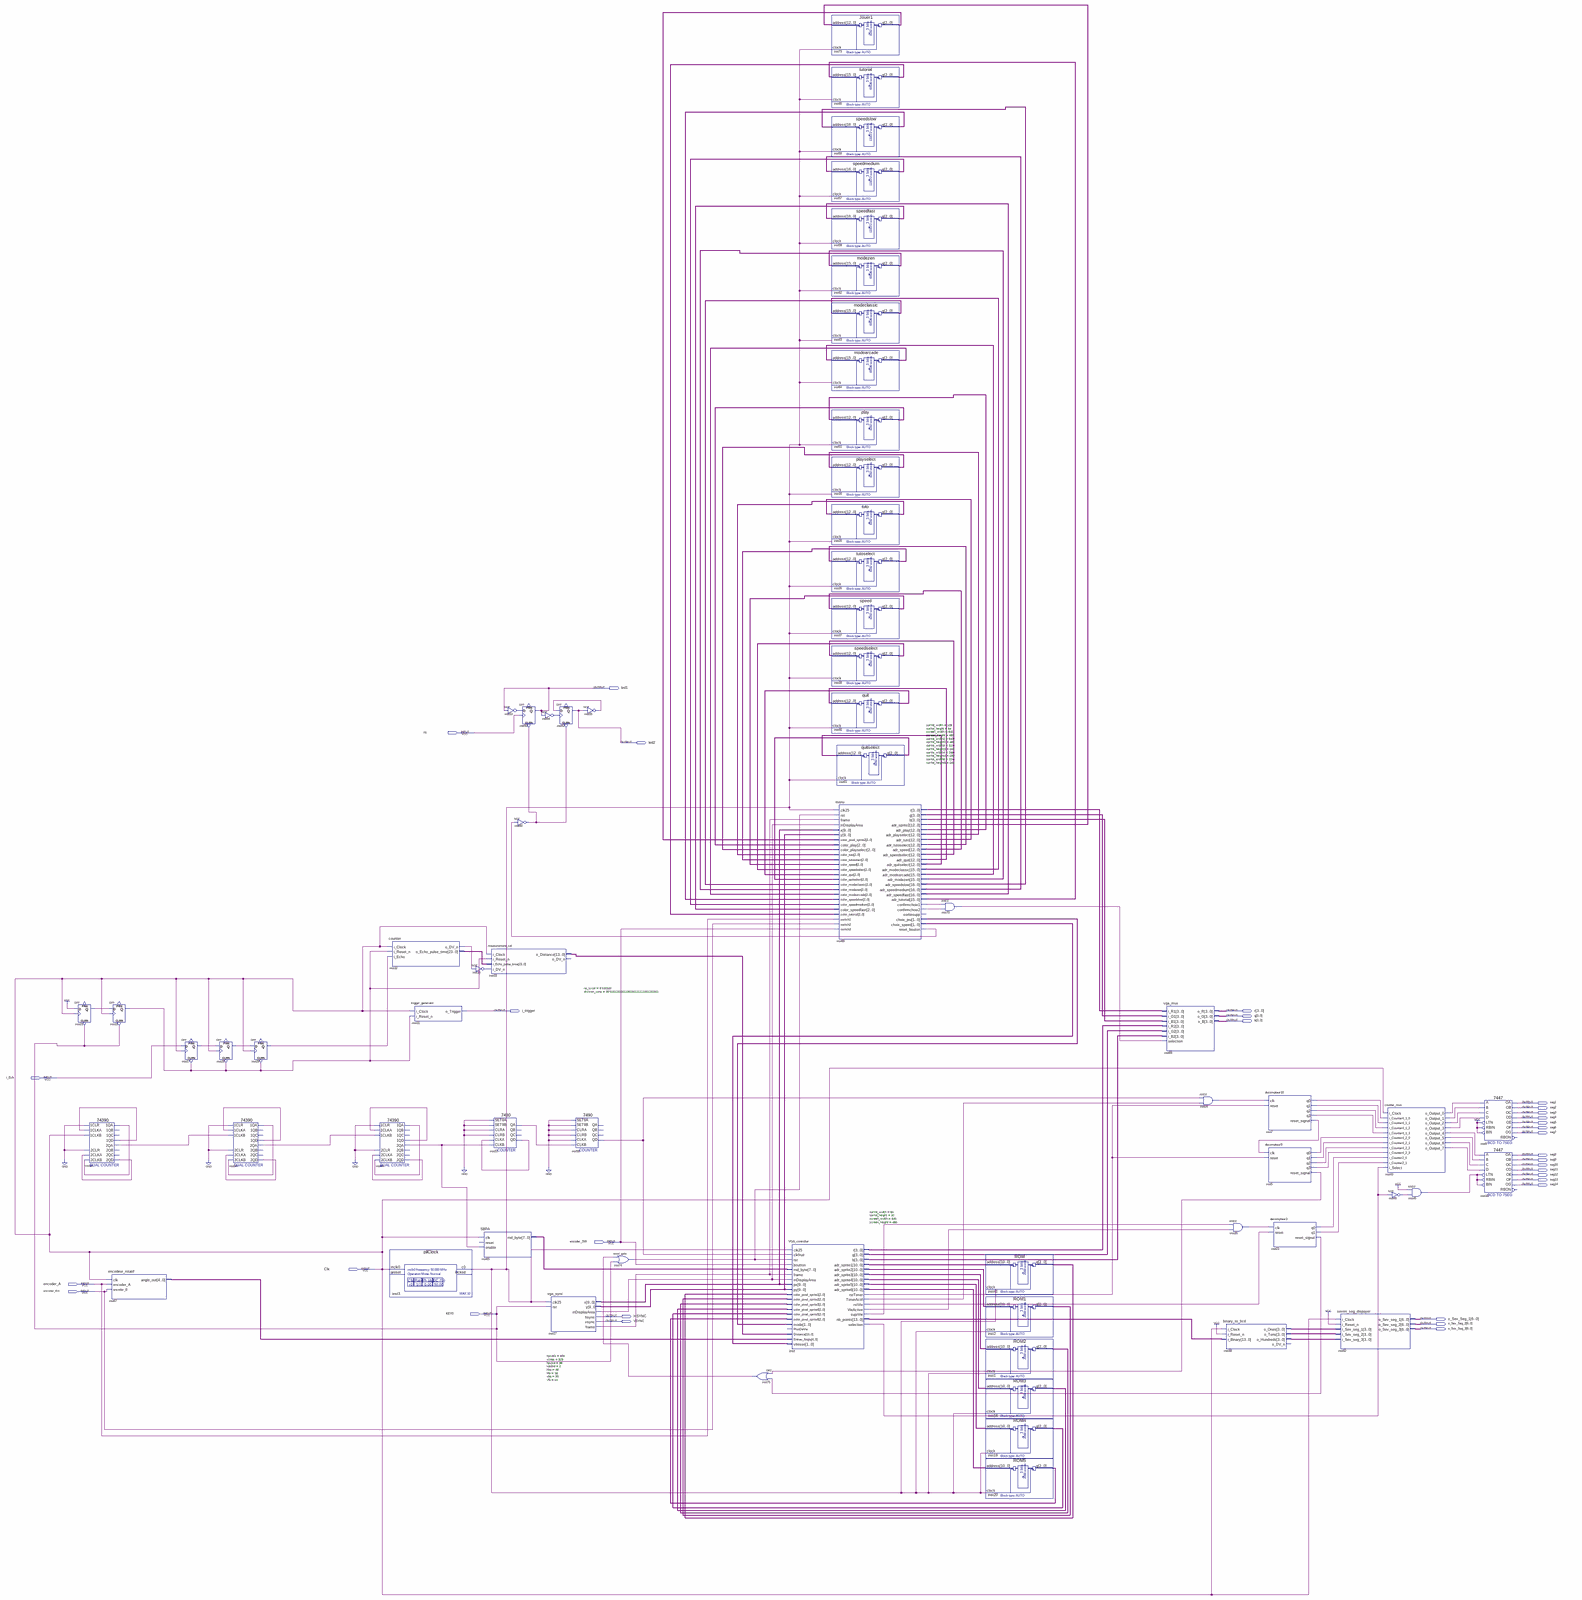
[diagram p0: schematic sheet, whole]
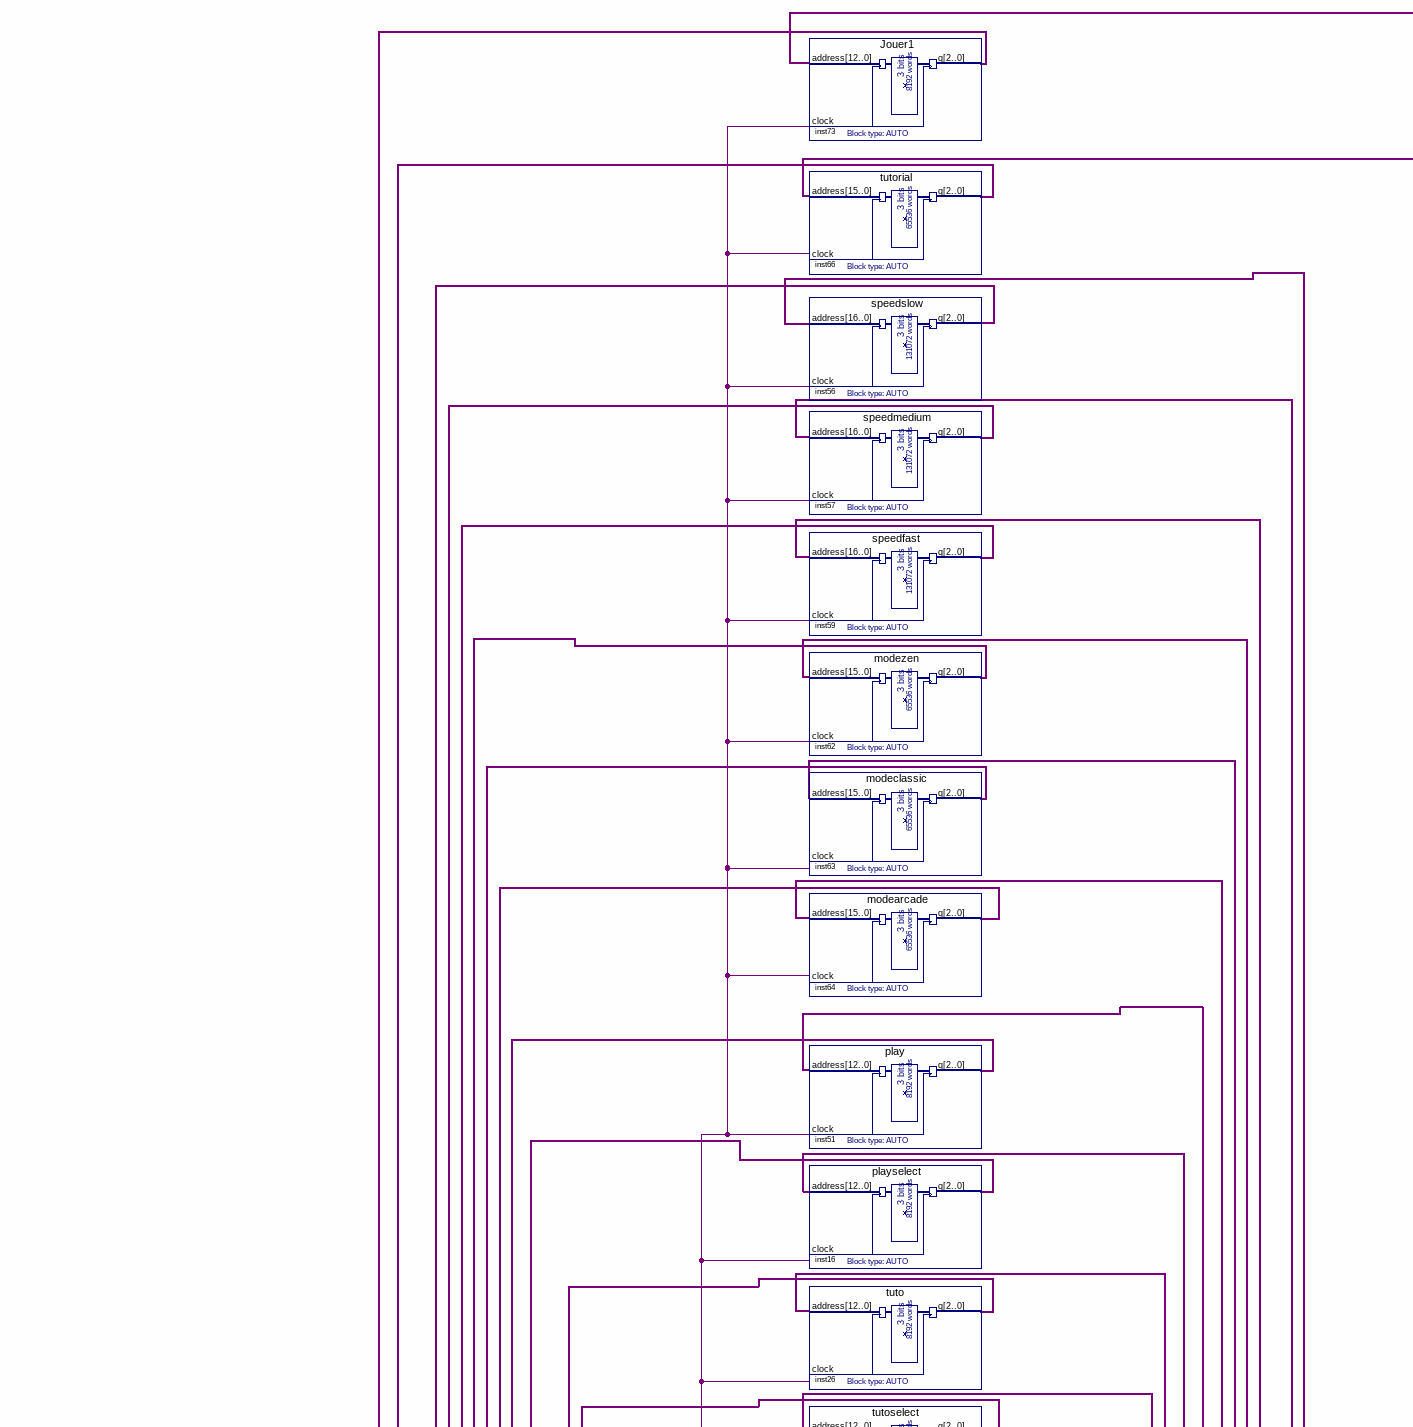
[diagram p1: schematic sheet, upper centre part]
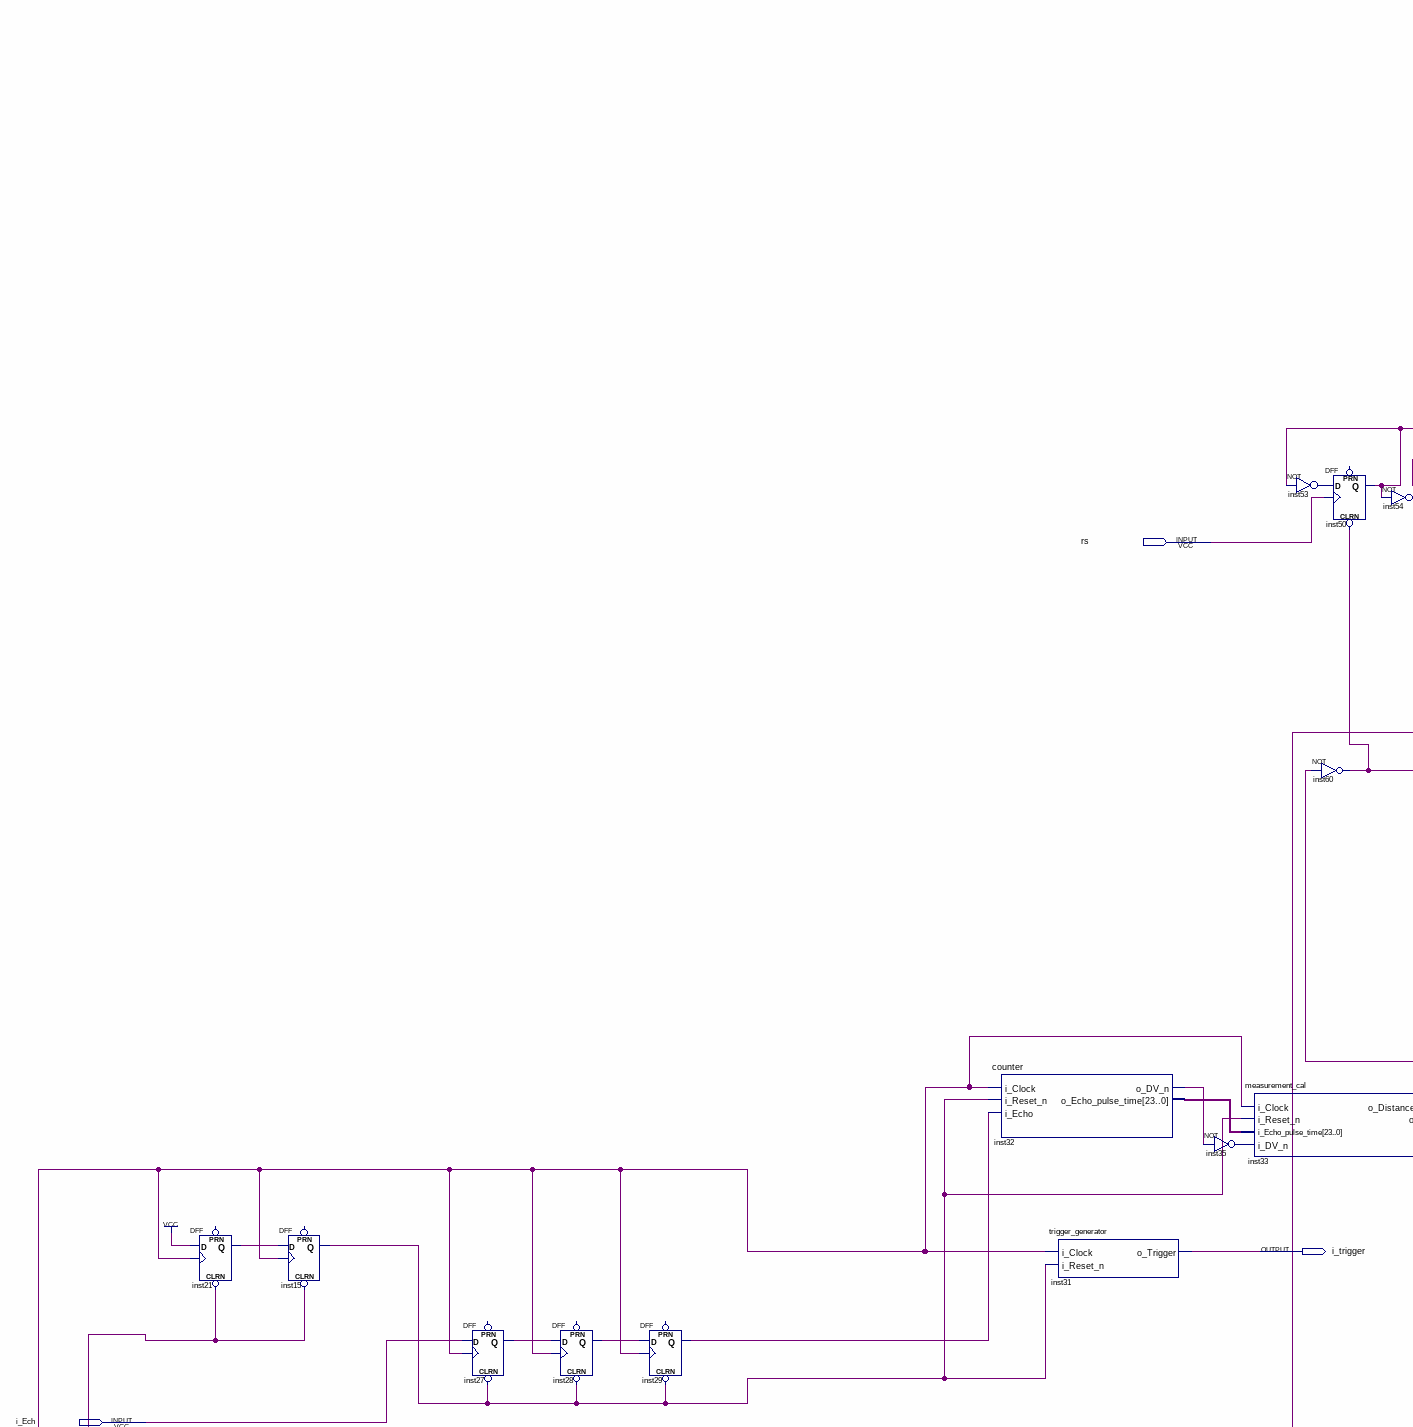
[diagram p2: schematic sheet, middle left part]
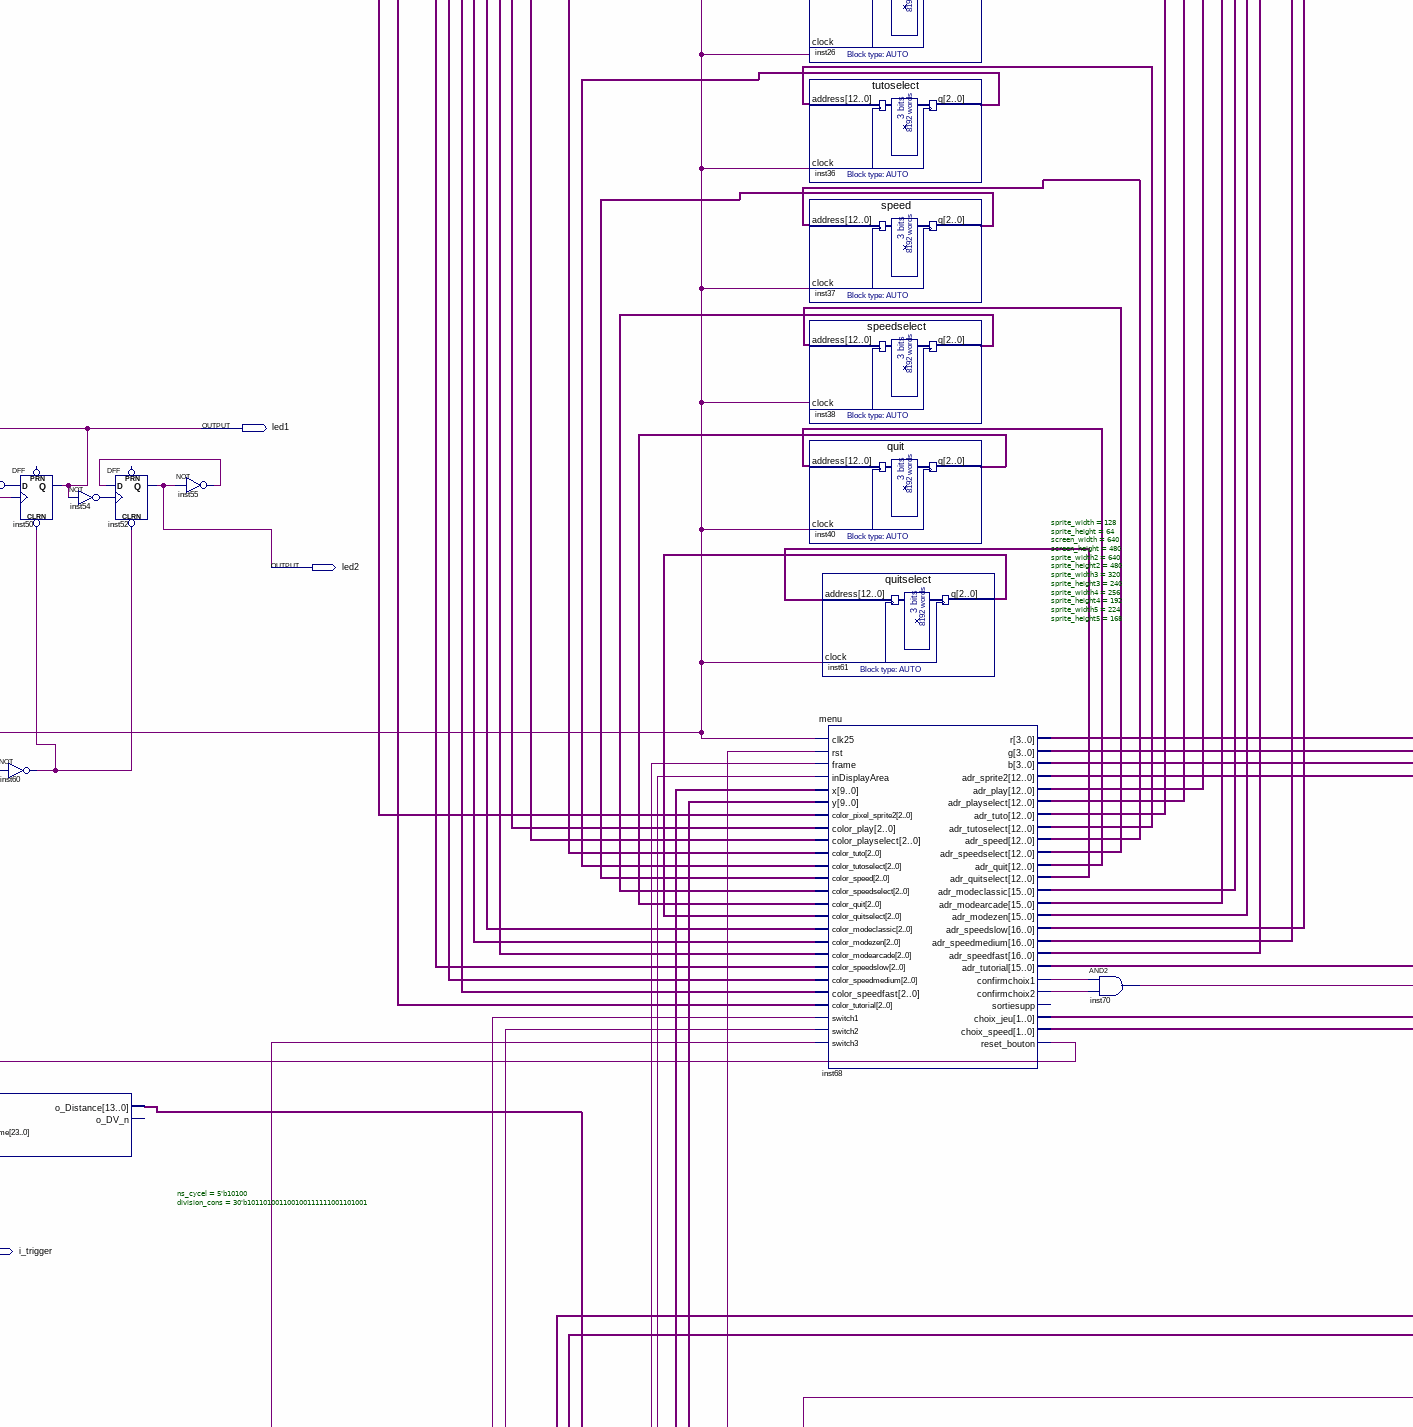
[diagram p3: schematic sheet, middle centre part]
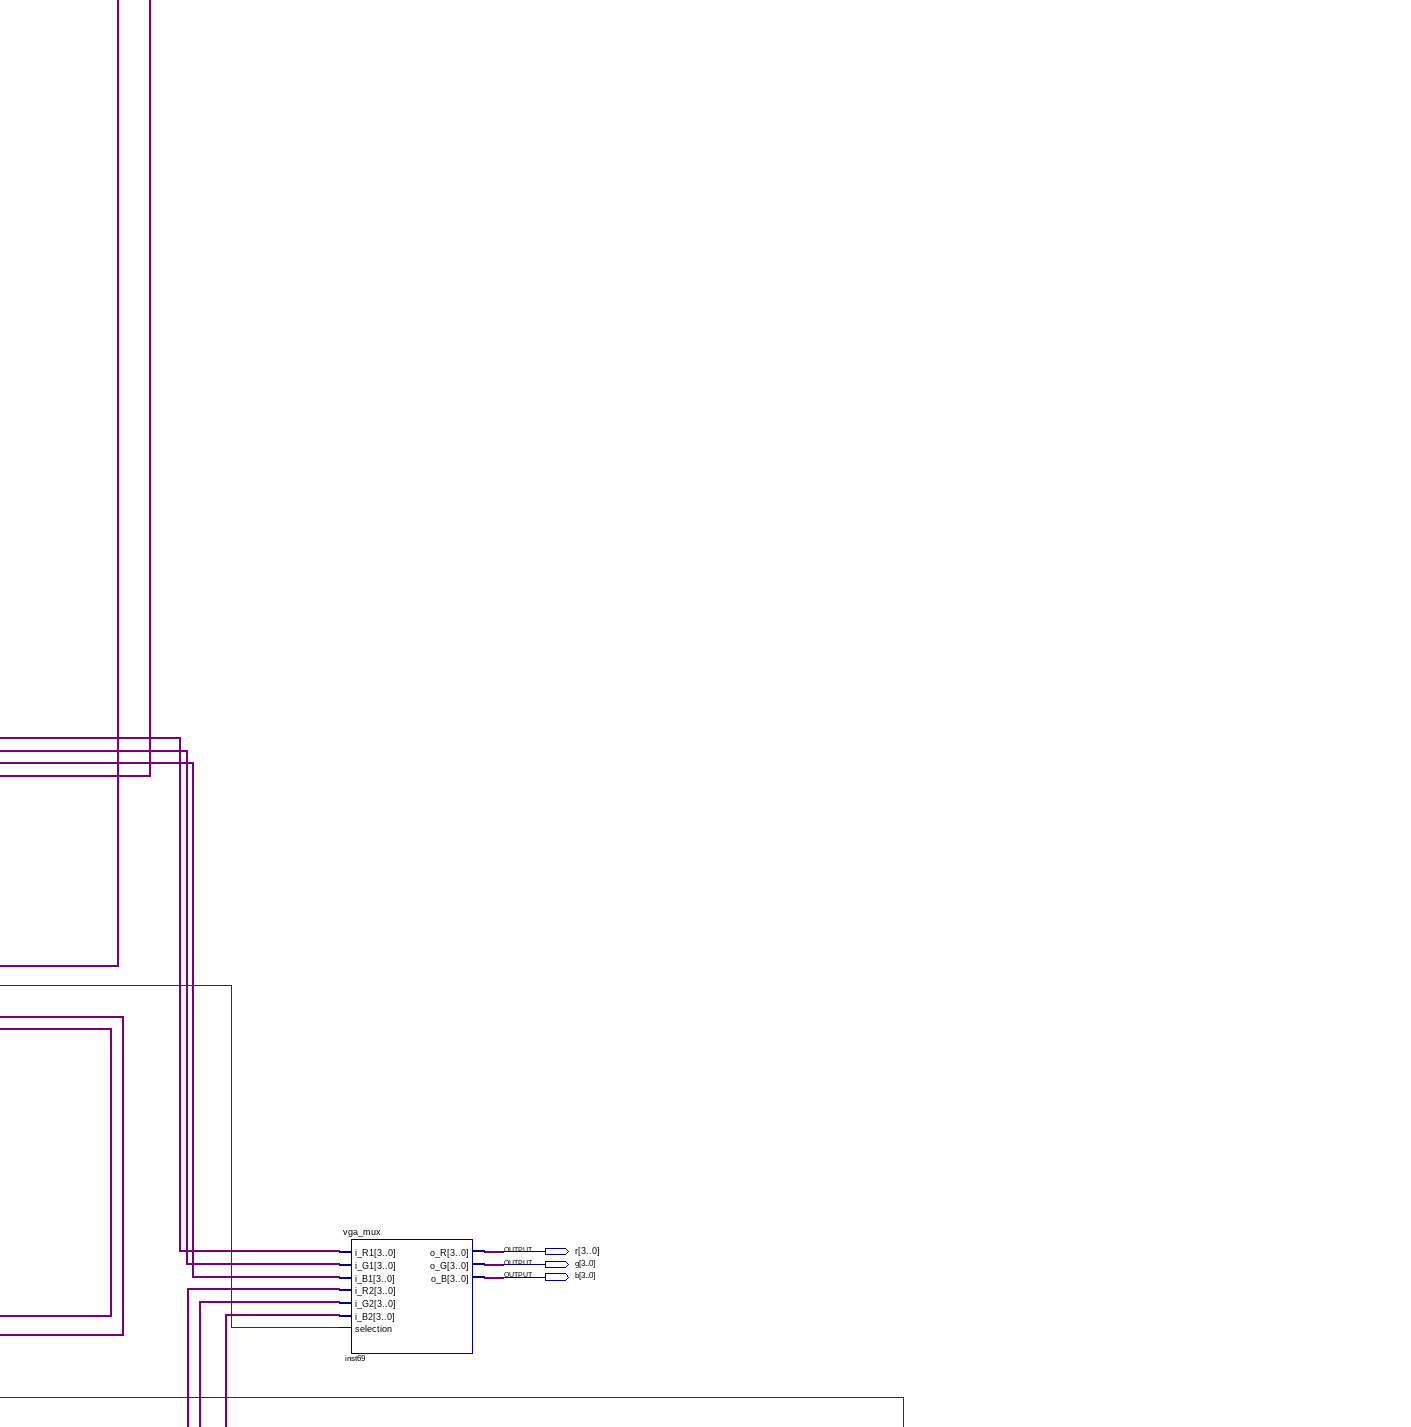
[diagram p4: schematic sheet, middle right part]
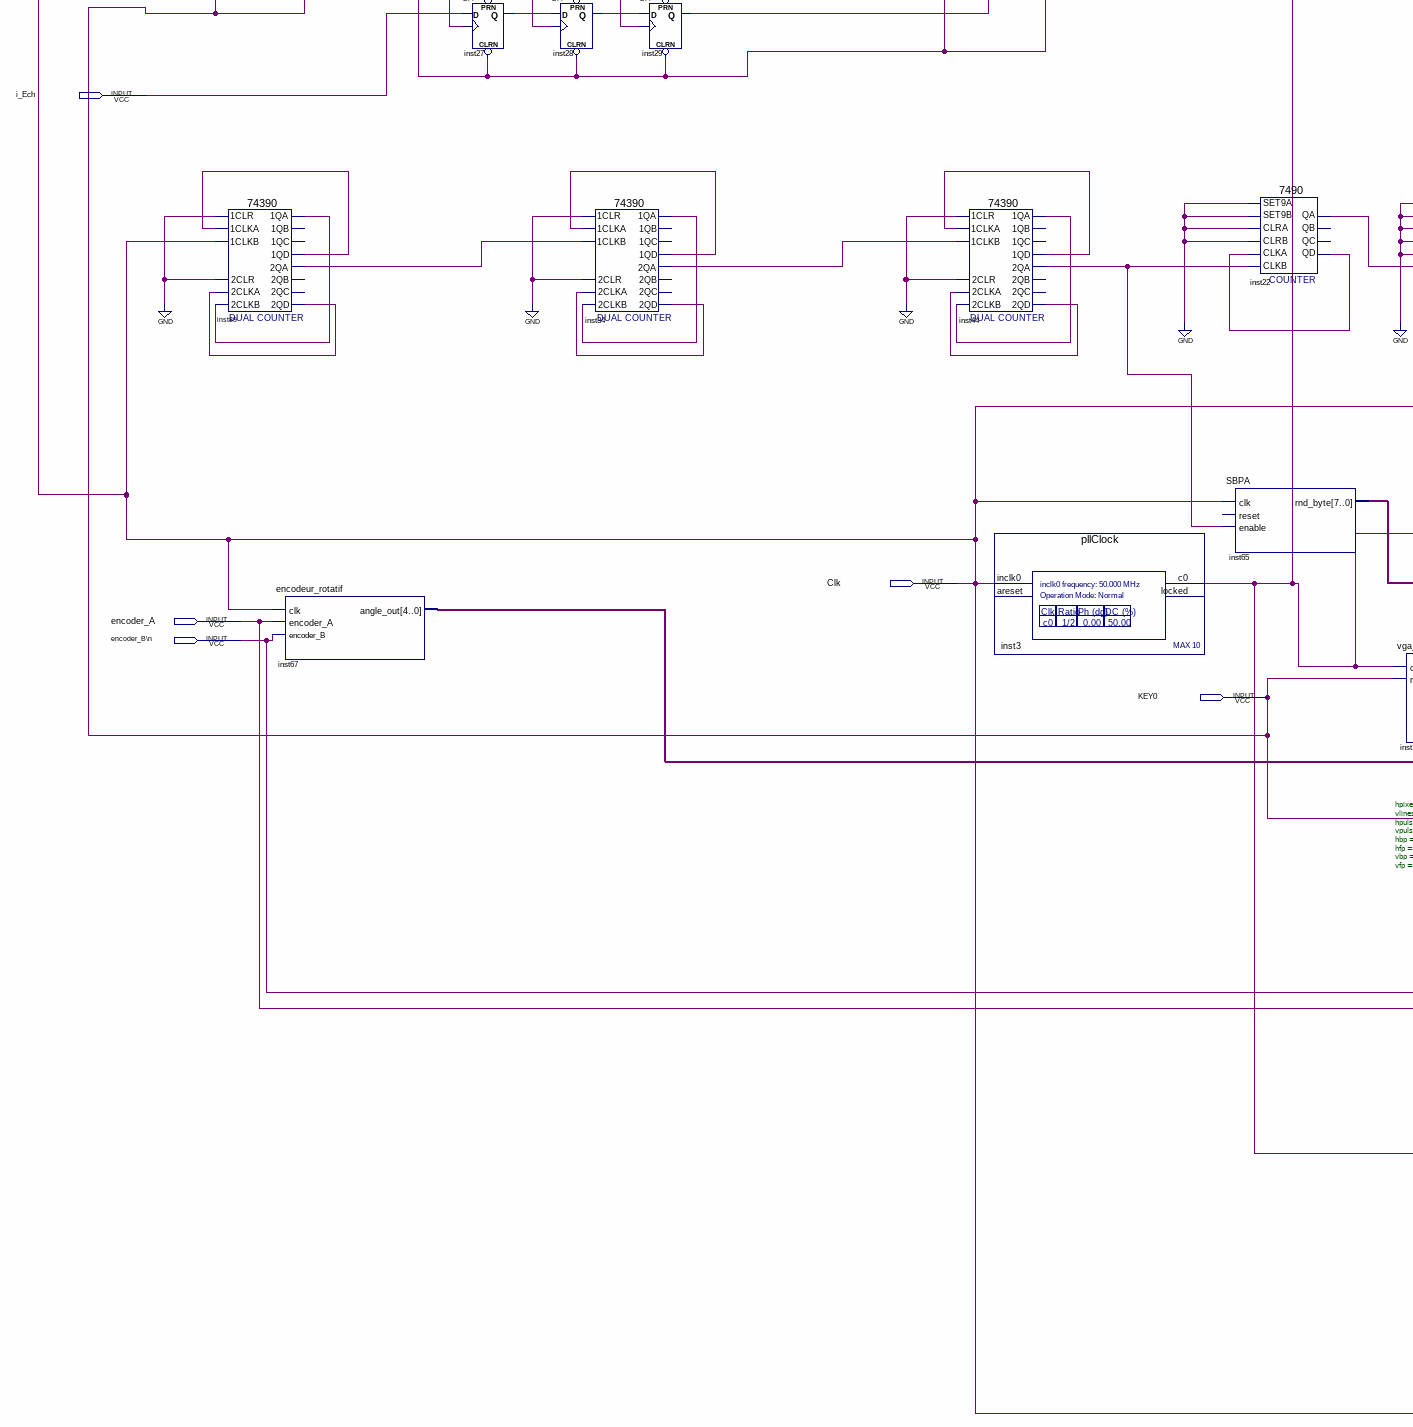
[diagram p5: schematic sheet, lower left part]
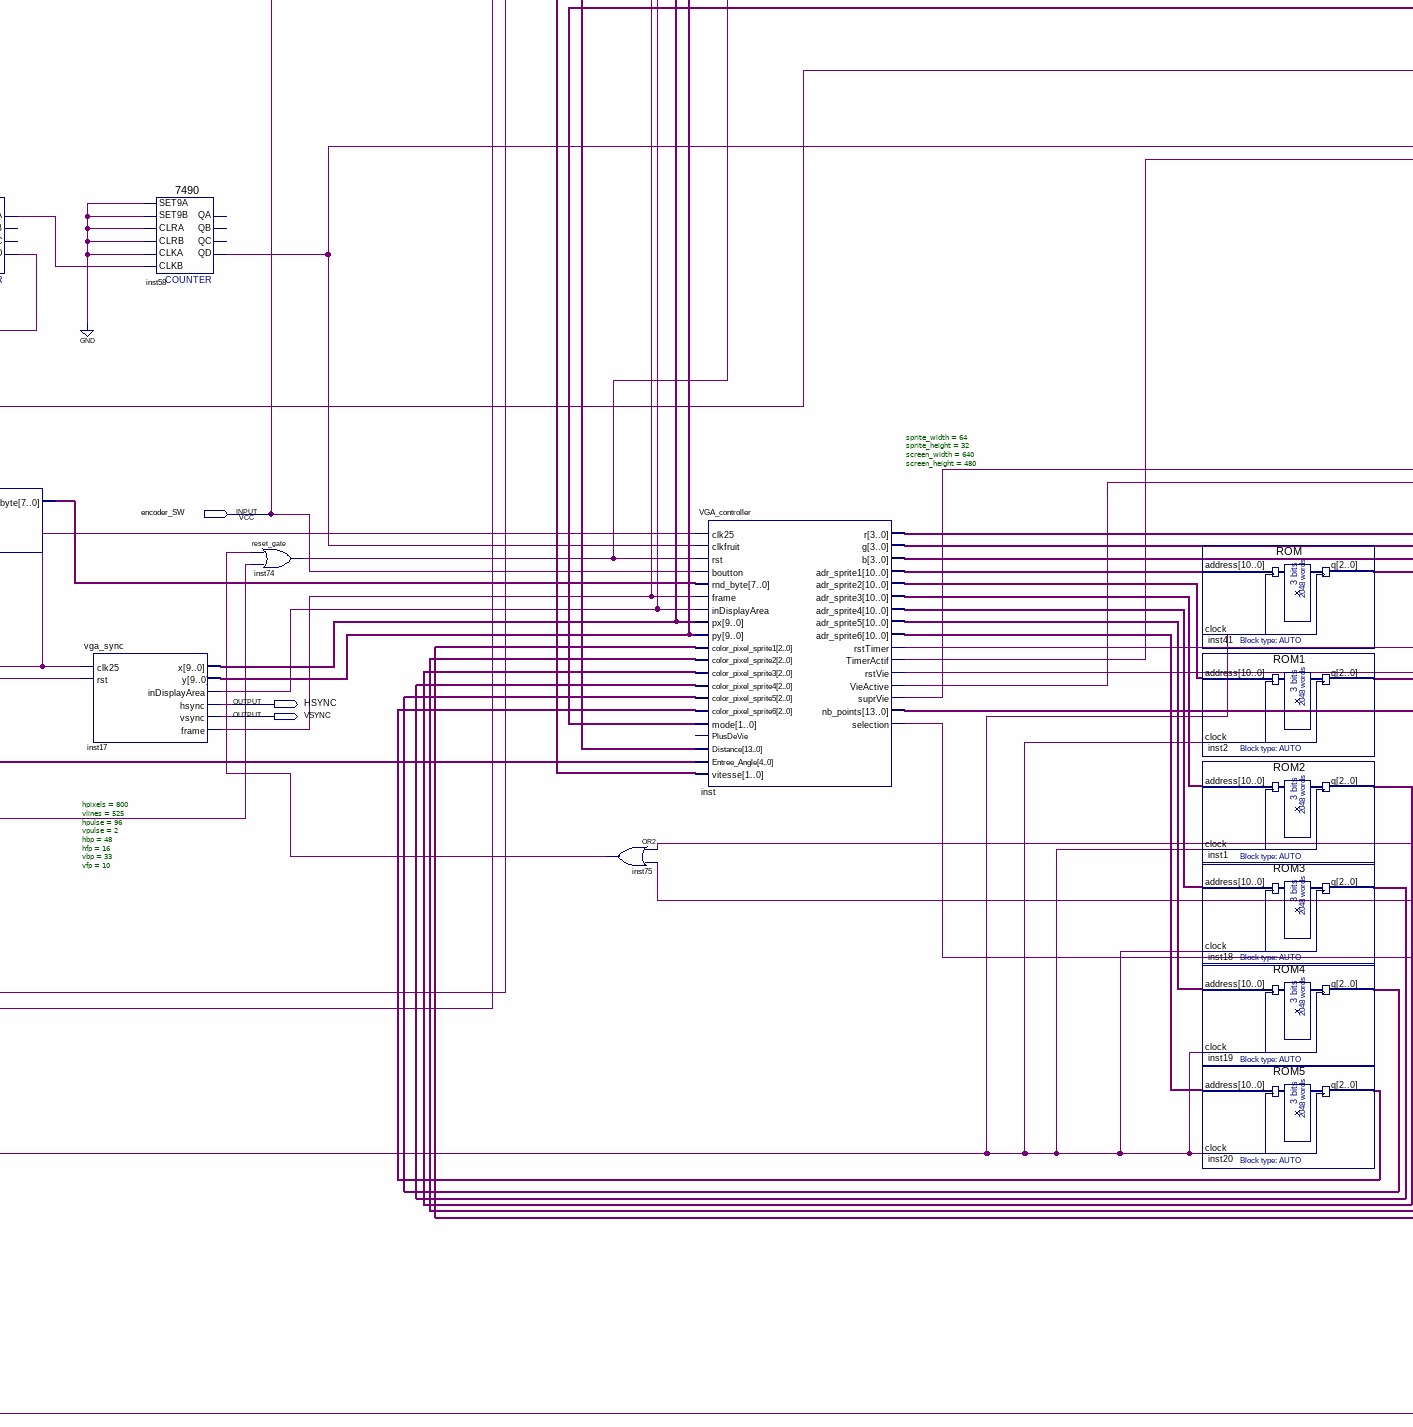
[diagram p6: schematic sheet, lower centre part]
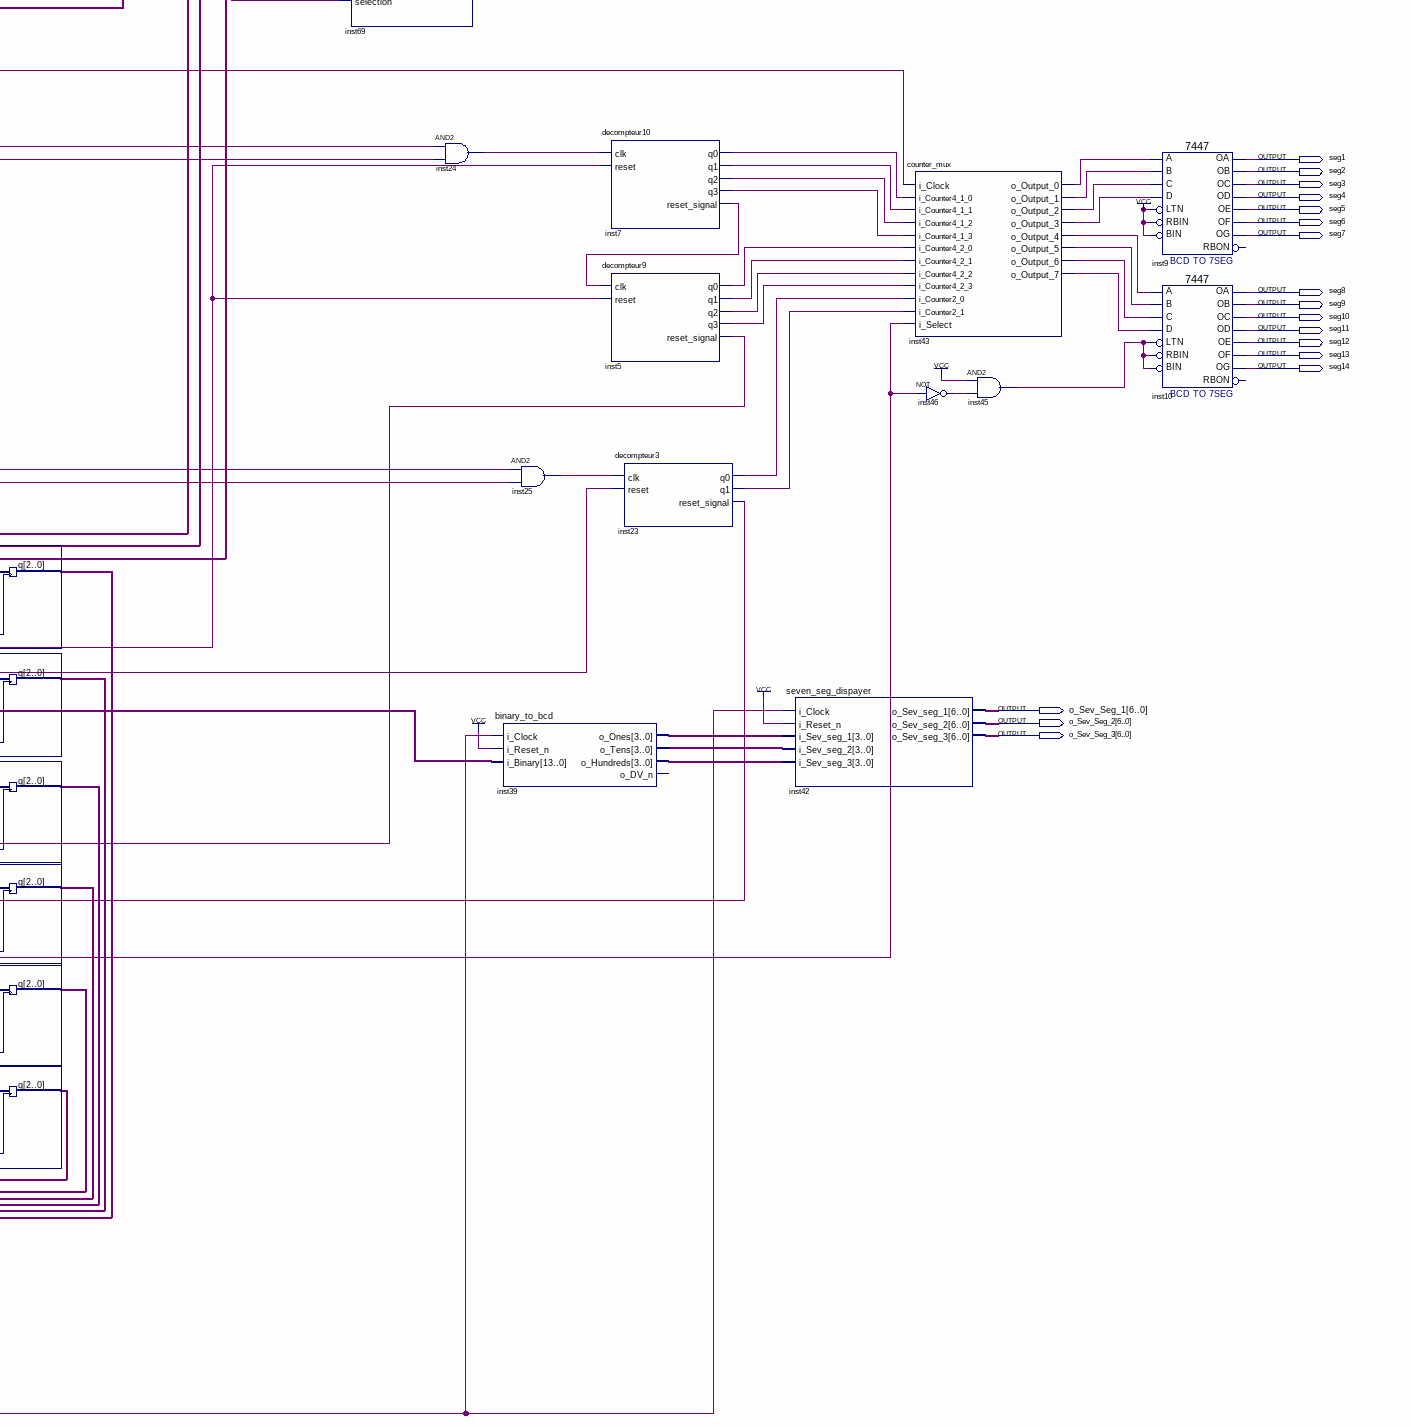
[diagram p7: schematic sheet, lower right part]
// Quartus schematic VGA_GAme2.bdf as structural Verilog: 64 symbols, 32 pins
module VGA_GAme2 (
  input  rs,
  input  i_Ech,
  input  encoder_SW,
  input  Clk,
  input  encoder_A,
  input  \encoder_B\n ,
  input  KEY0,
  output led1,
  output led2,
  output i_trigger,
  output [3:0] r,
  output [3:0] g,
  output [3:0] b,
  output seg1,
  output seg2,
  output seg3,
  output seg4,
  output seg5,
  output seg6,
  output seg7,
  output seg8,
  output seg9,
  output seg10,
  output seg11,
  output seg12,
  output seg13,
  output seg14,
  output HSYNC,
  output [6:0] o_Sev_Seg_1,
  output VSYNC,
  output [6:0] o_Sev_Seg_2,
  output [6:0] o_Sev_Seg_3
);

  wire inst3_c0, inst5_q0, inst5_q1, inst5_q2, inst5_q3, inst5_reset_signal, inst7_q0, inst7_q1, inst7_q2,
       inst7_q3, inst7_reset_signal, inst15_q, inst17_frame, inst17_indisplayarea, inst21_q, inst22_qa,
       inst22_qd, inst23_q0, inst23_q1, inst23_reset_signal, inst24_out, inst25_out, inst27_q, inst28_q,
       inst29_q, inst32_o_dv_n, inst34_1qa, inst34_1qd, inst34_2qa, inst34_2qd, inst35_out,
       inst43_o_output_0, inst43_o_output_1, inst43_o_output_2, inst43_o_output_3, inst43_o_output_4,
       inst43_o_output_5, inst43_o_output_6, inst43_o_output_7, inst44_1qa, inst44_1qd, inst44_2qa,
       inst44_2qd, inst45_out, inst46_out, inst53_out, inst54_out, inst55_out, inst58_qd, inst60_out,
       inst68_confirmchoix1, inst68_confirmchoix2, inst68_reset_bouton, inst70_out, inst74_reset_out,
       inst75_out, inst89_1qa, inst89_1qd, inst89_2qa, inst89_2qd, inst_rsttimer, inst_rstvie,
       inst_selection, inst_suprvie, inst_timeractif, inst_vieactive;
  wire [1:0] inst68_choix_jeu, inst68_choix_speed;
  wire [2:0] inst1_q, inst2_q, inst16_q, inst18_q, inst19_q, inst20_q, inst26_q, inst36_q, inst37_q,
       inst38_q, inst40_q, inst41_q, inst51_q, inst56_q, inst57_q, inst59_q, inst61_q, inst62_q, inst63_q,
       inst64_q, inst66_q, inst73_q;
  wire [3:0] inst39_o_hundreds, inst39_o_ones, inst39_o_tens, inst68_b, inst68_g, inst68_r, inst_b, inst_g,
       inst_r;
  wire [4:0] inst67_angle_out;
  wire [7:0] inst65_rnd_byte;
  wire [9:0] inst17_x, inst17_y;
  wire [10:0] inst_adr_sprite1, inst_adr_sprite2, inst_adr_sprite3, inst_adr_sprite4, inst_adr_sprite5,
       inst_adr_sprite6;
  wire [12:0] inst68_adr_play, inst68_adr_playselect, inst68_adr_quit, inst68_adr_quitselect,
       inst68_adr_speed, inst68_adr_speedselect, inst68_adr_sprite2, inst68_adr_tuto, inst68_adr_tutoselect;
  wire [13:0] inst33_o_distance, inst_nb_points;
  wire [15:0] inst68_adr_modearcade, inst68_adr_modeclassic, inst68_adr_modezen, inst68_adr_tutorial;
  wire [16:0] inst68_adr_speedfast, inst68_adr_speedmedium, inst68_adr_speedslow;
  wire [23:0] inst32_o_echo_pulse_time;

  DFF inst21 (.CLRN(KEY0), .CLK(Clk), .D(1'b1), .Q(inst21_q));  // open: PRN
  \74390  inst89 (
    .\2CLKA (inst89_2qd), .\2CLR (1'b0), .\2CLKB (inst89_1qa), .\1CLR (1'b0), .\1CLKA (inst89_1qd),
    .\1CLKB (Clk), .\1QA (inst89_1qa), .\1QD (inst89_1qd), .\2QA (inst89_2qa), .\2QD (inst89_2qd));  // open: 1QB, 1QC, 2QB, 2QC
  DFF inst15 (.CLRN(KEY0), .CLK(Clk), .D(inst21_q), .Q(inst15_q));  // open: PRN
  encodeur_rotatif inst67 (.clk(Clk), .encoder_A(encoder_A), .encoder_B(\encoder_B\n ), .angle_out(inst67_angle_out));
  DFF inst27 (.CLRN(inst15_q), .CLK(Clk), .D(i_Ech), .Q(inst27_q));  // open: PRN
  DFF inst28 (.CLRN(inst15_q), .CLK(Clk), .D(inst27_q), .Q(inst28_q));  // open: PRN
  \74390  inst34 (
    .\2CLKA (inst34_2qd), .\2CLR (1'b0), .\2CLKB (inst34_1qa), .\1CLR (1'b0), .\1CLKA (inst34_1qd),
    .\1CLKB (inst89_2qa), .\1QA (inst34_1qa), .\1QD (inst34_1qd), .\2QA (inst34_2qa), .\2QD (inst34_2qd));  // open: 1QB, 1QC, 2QB, 2QC
  DFF inst29 (.CLRN(inst15_q), .CLK(Clk), .D(inst28_q), .Q(inst29_q));  // open: PRN
  \74390  inst44 (
    .\2CLKA (inst44_2qd), .\2CLR (1'b0), .\2CLKB (inst44_1qa), .\1CLR (1'b0), .\1CLKA (inst44_1qd),
    .\1CLKB (inst34_2qa), .\1QA (inst44_1qa), .\1QD (inst44_1qd), .\2QA (inst44_2qa), .\2QD (inst44_2qd));  // open: 1QB, 1QC, 2QB, 2QC
  counter inst32 (
    .i_Clock(Clk), .i_Reset_n(inst15_q), .i_Echo(inst29_q), .o_DV_n(inst32_o_dv_n),
    .o_Echo_pulse_time(inst32_o_echo_pulse_time));
  pllClock inst3 (.inclk0(Clk), .c0(inst3_c0));  // open: areset, locked
  trigger_generator inst31 (.i_Clock(Clk), .i_Reset_n(inst15_q), .o_Trigger(i_trigger));
  not inst35 (inst35_out, inst32_o_dv_n);
  measurement_cal #(.ns_cycel(5'b10100), .division_cons(30'b101101001100100111111001101001)) inst33 (
    .i_Clock(Clk), .i_Reset_n(inst15_q), .i_Echo_pulse_time(inst32_o_echo_pulse_time), .i_DV_n(inst35_out),
    .o_Distance(inst33_o_distance));  // open: o_DV_n
  \7490  inst22 (
    .SET9A(1'b0), .CLRA(1'b0), .SET9B(1'b0), .CLKB(inst44_2qa), .CLKA(inst22_qd), .CLRB(1'b0),
    .QD(inst22_qd), .QA(inst22_qa));  // open: QB, QC
  SBPA inst65 (.clk(Clk), .enable(inst44_2qa), .rnd_byte(inst65_rnd_byte));  // open: reset
  not inst53 (inst53_out, led1);
  not inst60 (inst60_out, inst68_reset_bouton);
  DFF inst50 (.CLRN(inst60_out), .CLK(rs), .D(inst53_out), .Q(led1));  // open: PRN
  not inst54 (inst54_out, led1);
  vga_sync #(.hpixels(800), .vlines(525), .hpulse(96), .vpulse(2), .hbp(48), .hfp(16), .vbp(33), .vfp(10)) inst17 (
    .clk25(inst3_c0), .rst(KEY0), .x(inst17_x), .y(inst17_y), .inDisplayArea(inst17_indisplayarea),
    .hsync(HSYNC), .vsync(VSYNC), .frame(inst17_frame));
  DFF inst52 (.CLRN(inst60_out), .CLK(inst54_out), .D(inst55_out), .Q(led2));  // open: PRN
  \7490  inst58 (
    .SET9A(1'b0), .CLRA(1'b0), .SET9B(1'b0), .CLKB(inst22_qa), .CLKA(1'b0), .CLRB(1'b0), .QD(inst58_qd));  // open: QA, QB, QC
  not inst55 (inst55_out, led2);
  reset_gate inst74 (.IN2(KEY0), .IN1(inst75_out), .reset_out(inst74_reset_out));
  or inst75 (inst75_out, inst5_reset_signal, inst23_reset_signal);
  VGA_controller #(.sprite_width(64), .sprite_height(32), .screen_width(640), .screen_height(480)) inst (
    .clk25(inst3_c0), .clkfruit(inst58_qd), .rst(inst74_reset_out), .boutton(encoder_SW),
    .rnd_byte(inst65_rnd_byte), .frame(inst17_frame), .inDisplayArea(inst17_indisplayarea), .px(inst17_x),
    .py(inst17_y), .color_pixel_sprite1(inst41_q), .color_pixel_sprite2(inst2_q),
    .color_pixel_sprite3(inst1_q), .color_pixel_sprite4(inst18_q), .color_pixel_sprite5(inst19_q),
    .color_pixel_sprite6(inst20_q), .mode(inst68_choix_jeu), .Distance(inst33_o_distance),
    .Entree_Angle(inst67_angle_out), .vitesse(inst68_choix_speed), .r(inst_r), .g(inst_g), .b(inst_b),
    .adr_sprite1(inst_adr_sprite1), .adr_sprite2(inst_adr_sprite2), .adr_sprite3(inst_adr_sprite3),
    .adr_sprite4(inst_adr_sprite4), .adr_sprite5(inst_adr_sprite5), .adr_sprite6(inst_adr_sprite6),
    .rstTimer(inst_rsttimer), .TimerActif(inst_timeractif), .rstVie(inst_rstvie), .VieActive(inst_vieactive),
    .suprVie(inst_suprvie), .nb_points(inst_nb_points), .selection(inst_selection));  // open: PlusDeVie
  Jouer1 inst73 (.address(inst68_adr_sprite2), .clock(inst3_c0), .q(inst73_q));
  tutorial inst66 (.address(inst68_adr_tutorial), .clock(inst3_c0), .q(inst66_q));
  speedslow inst56 (.address(inst68_adr_speedslow), .clock(inst3_c0), .q(inst56_q));
  speedmedium inst57 (.address(inst68_adr_speedmedium), .clock(inst3_c0), .q(inst57_q));
  speedfast inst59 (.address(inst68_adr_speedfast), .clock(inst3_c0), .q(inst59_q));
  modezen inst62 (.address(inst68_adr_modezen), .clock(inst3_c0), .q(inst62_q));
  modeclassic inst63 (.address(inst68_adr_modeclassic), .clock(inst3_c0), .q(inst63_q));
  modearcade inst64 (.address(inst68_adr_modearcade), .clock(inst3_c0), .q(inst64_q));
  play inst51 (.address(inst68_adr_play), .clock(inst3_c0), .q(inst51_q));
  playselect inst16 (.address(inst68_adr_playselect), .clock(inst3_c0), .q(inst16_q));
  tuto inst26 (.address(inst68_adr_tuto), .clock(inst3_c0), .q(inst26_q));
  tutoselect inst36 (.address(inst68_adr_tutoselect), .clock(inst3_c0), .q(inst36_q));
  speed inst37 (.address(inst68_adr_speed), .clock(inst3_c0), .q(inst37_q));
  speedselect inst38 (.address(inst68_adr_speedselect), .clock(inst3_c0), .q(inst38_q));
  quit inst40 (.address(inst68_adr_quit), .clock(inst3_c0), .q(inst40_q));
  quitselect inst61 (.address(inst68_adr_quitselect), .clock(inst3_c0), .q(inst61_q));
  menu #(.sprite_width(128), .sprite_height(64), .screen_width(640), .screen_height(480), .sprite_width2(640), .sprite_height2(480), .sprite_width3(320), .sprite_height3(240), .sprite_width4(256), .sprite_height4(192), .sprite_width5(224), .sprite_height5(168)) inst68 (
    .clk25(inst3_c0), .rst(inst74_reset_out), .frame(inst17_frame), .inDisplayArea(inst17_indisplayarea),
    .x(inst17_x), .y(inst17_y), .color_pixel_sprite2(inst73_q), .color_play(inst51_q),
    .color_playselect(inst16_q), .color_tuto(inst26_q), .color_tutoselect(inst36_q), .color_speed(inst37_q),
    .color_speedselect(inst38_q), .color_quit(inst40_q), .color_quitselect(inst61_q),
    .color_modeclassic(inst63_q), .color_modezen(inst62_q), .color_modearcade(inst64_q),
    .color_speedslow(inst56_q), .color_speedmedium(inst57_q), .color_speedfast(inst59_q),
    .color_tutorial(inst66_q), .switch1(encoder_A), .switch2(\encoder_B\n ), .switch3(encoder_SW),
    .r(inst68_r), .g(inst68_g), .b(inst68_b), .adr_sprite2(inst68_adr_sprite2), .adr_play(inst68_adr_play),
    .adr_playselect(inst68_adr_playselect), .adr_tuto(inst68_adr_tuto),
    .adr_tutoselect(inst68_adr_tutoselect), .adr_speed(inst68_adr_speed),
    .adr_speedselect(inst68_adr_speedselect), .adr_quit(inst68_adr_quit),
    .adr_quitselect(inst68_adr_quitselect), .adr_modeclassic(inst68_adr_modeclassic),
    .adr_modearcade(inst68_adr_modearcade), .adr_modezen(inst68_adr_modezen),
    .adr_speedslow(inst68_adr_speedslow), .adr_speedmedium(inst68_adr_speedmedium),
    .adr_speedfast(inst68_adr_speedfast), .adr_tutorial(inst68_adr_tutorial),
    .confirmchoix1(inst68_confirmchoix1), .confirmchoix2(inst68_confirmchoix2), .choix_jeu(inst68_choix_jeu),
    .choix_speed(inst68_choix_speed), .reset_bouton(inst68_reset_bouton));  // open: sortiesupp
  and inst70 (inst70_out, inst68_confirmchoix1, inst68_confirmchoix2);
  ROM inst41 (.address(inst_adr_sprite1), .clock(inst3_c0), .q(inst41_q));
  ROM1 inst2 (.address(inst_adr_sprite2), .clock(inst3_c0), .q(inst2_q));
  ROM2 inst1 (.address(inst_adr_sprite3), .clock(inst3_c0), .q(inst1_q));
  ROM3 inst18 (.address(inst_adr_sprite4), .clock(inst3_c0), .q(inst18_q));
  ROM4 inst19 (.address(inst_adr_sprite5), .clock(inst3_c0), .q(inst19_q));
  ROM5 inst20 (.address(inst_adr_sprite6), .clock(inst3_c0), .q(inst20_q));
  vga_mux inst69 (
    .i_R1(inst68_r), .i_G1(inst68_g), .i_B1(inst68_b), .i_R2(inst_r), .i_G2(inst_g), .i_B2(inst_b),
    .selection(inst70_out), .o_R(r), .o_G(g), .o_B(b));
  and inst24 (inst24_out, inst58_qd, inst_timeractif);
  and inst25 (inst25_out, inst_suprvie, inst_vieactive);
  binary_to_bcd inst39 (
    .i_Clock(Clk), .i_Reset_n(1'b1), .i_Binary(inst_nb_points), .o_Ones(inst39_o_ones),
    .o_Tens(inst39_o_tens), .o_Hundreds(inst39_o_hundreds));  // open: o_DV_n
  decompteur10 inst7 (
    .clk(inst24_out), .reset(inst_rsttimer), .q0(inst7_q0), .q1(inst7_q1), .q2(inst7_q2), .q3(inst7_q3),
    .reset_signal(inst7_reset_signal));
  decompteur9 inst5 (
    .clk(inst7_reset_signal), .reset(inst_rsttimer), .q0(inst5_q0), .q1(inst5_q1), .q2(inst5_q2),
    .q3(inst5_q3), .reset_signal(inst5_reset_signal));
  decompteur3 inst23 (
    .clk(inst25_out), .reset(inst_rstvie), .q0(inst23_q0), .q1(inst23_q1), .reset_signal(inst23_reset_signal));
  seven_seg_dispayer inst42 (
    .i_Clock(Clk), .i_Reset_n(1'b1), .i_Sev_seg_1(inst39_o_ones), .i_Sev_seg_2(inst39_o_tens),
    .i_Sev_seg_3(inst39_o_hundreds), .o_Sev_seg_1(o_Sev_Seg_1), .o_Sev_seg_2(o_Sev_Seg_2),
    .o_Sev_seg_3(o_Sev_Seg_3));
  counter_mux inst43 (
    .i_Clock(Clk), .i_Counter4_1_0(inst7_q0), .i_Counter4_1_1(inst7_q1), .i_Counter4_1_2(inst7_q2),
    .i_Counter4_1_3(inst7_q3), .i_Counter4_2_0(inst5_q0), .i_Counter4_2_1(inst5_q1),
    .i_Counter4_2_2(inst5_q2), .i_Counter4_2_3(inst5_q3), .i_Counter2_0(inst23_q0), .i_Counter2_1(inst23_q1),
    .i_Select(inst_selection), .o_Output_0(inst43_o_output_0), .o_Output_1(inst43_o_output_1),
    .o_Output_2(inst43_o_output_2), .o_Output_3(inst43_o_output_3), .o_Output_4(inst43_o_output_4),
    .o_Output_5(inst43_o_output_5), .o_Output_6(inst43_o_output_6), .o_Output_7(inst43_o_output_7));
  not inst46 (inst46_out, inst_selection);
  and inst45 (inst45_out, 1'b1, inst46_out);
  \7447  inst9 (
    .LTN(1'b1), .B(inst43_o_output_1), .C(inst43_o_output_2), .D(inst43_o_output_3), .RBIN(1'b1), .BIN(1'b1),
    .A(inst43_o_output_0), .OB(seg2), .OC(seg3), .OE(seg5), .OD(seg4), .OF(seg6), .OG(seg7), .OA(seg1));  // open: RBON
  \7447  inst10 (
    .LTN(inst45_out), .B(inst43_o_output_5), .C(inst43_o_output_6), .D(inst43_o_output_7), .RBIN(inst45_out),
    .BIN(inst45_out), .A(inst43_o_output_4), .OB(seg9), .OC(seg10), .OE(seg12), .OD(seg11), .OF(seg13),
    .OG(seg14), .OA(seg8));  // open: RBON
endmodule
